# EAGLE design saha-display (EAGLE 9.4.0)
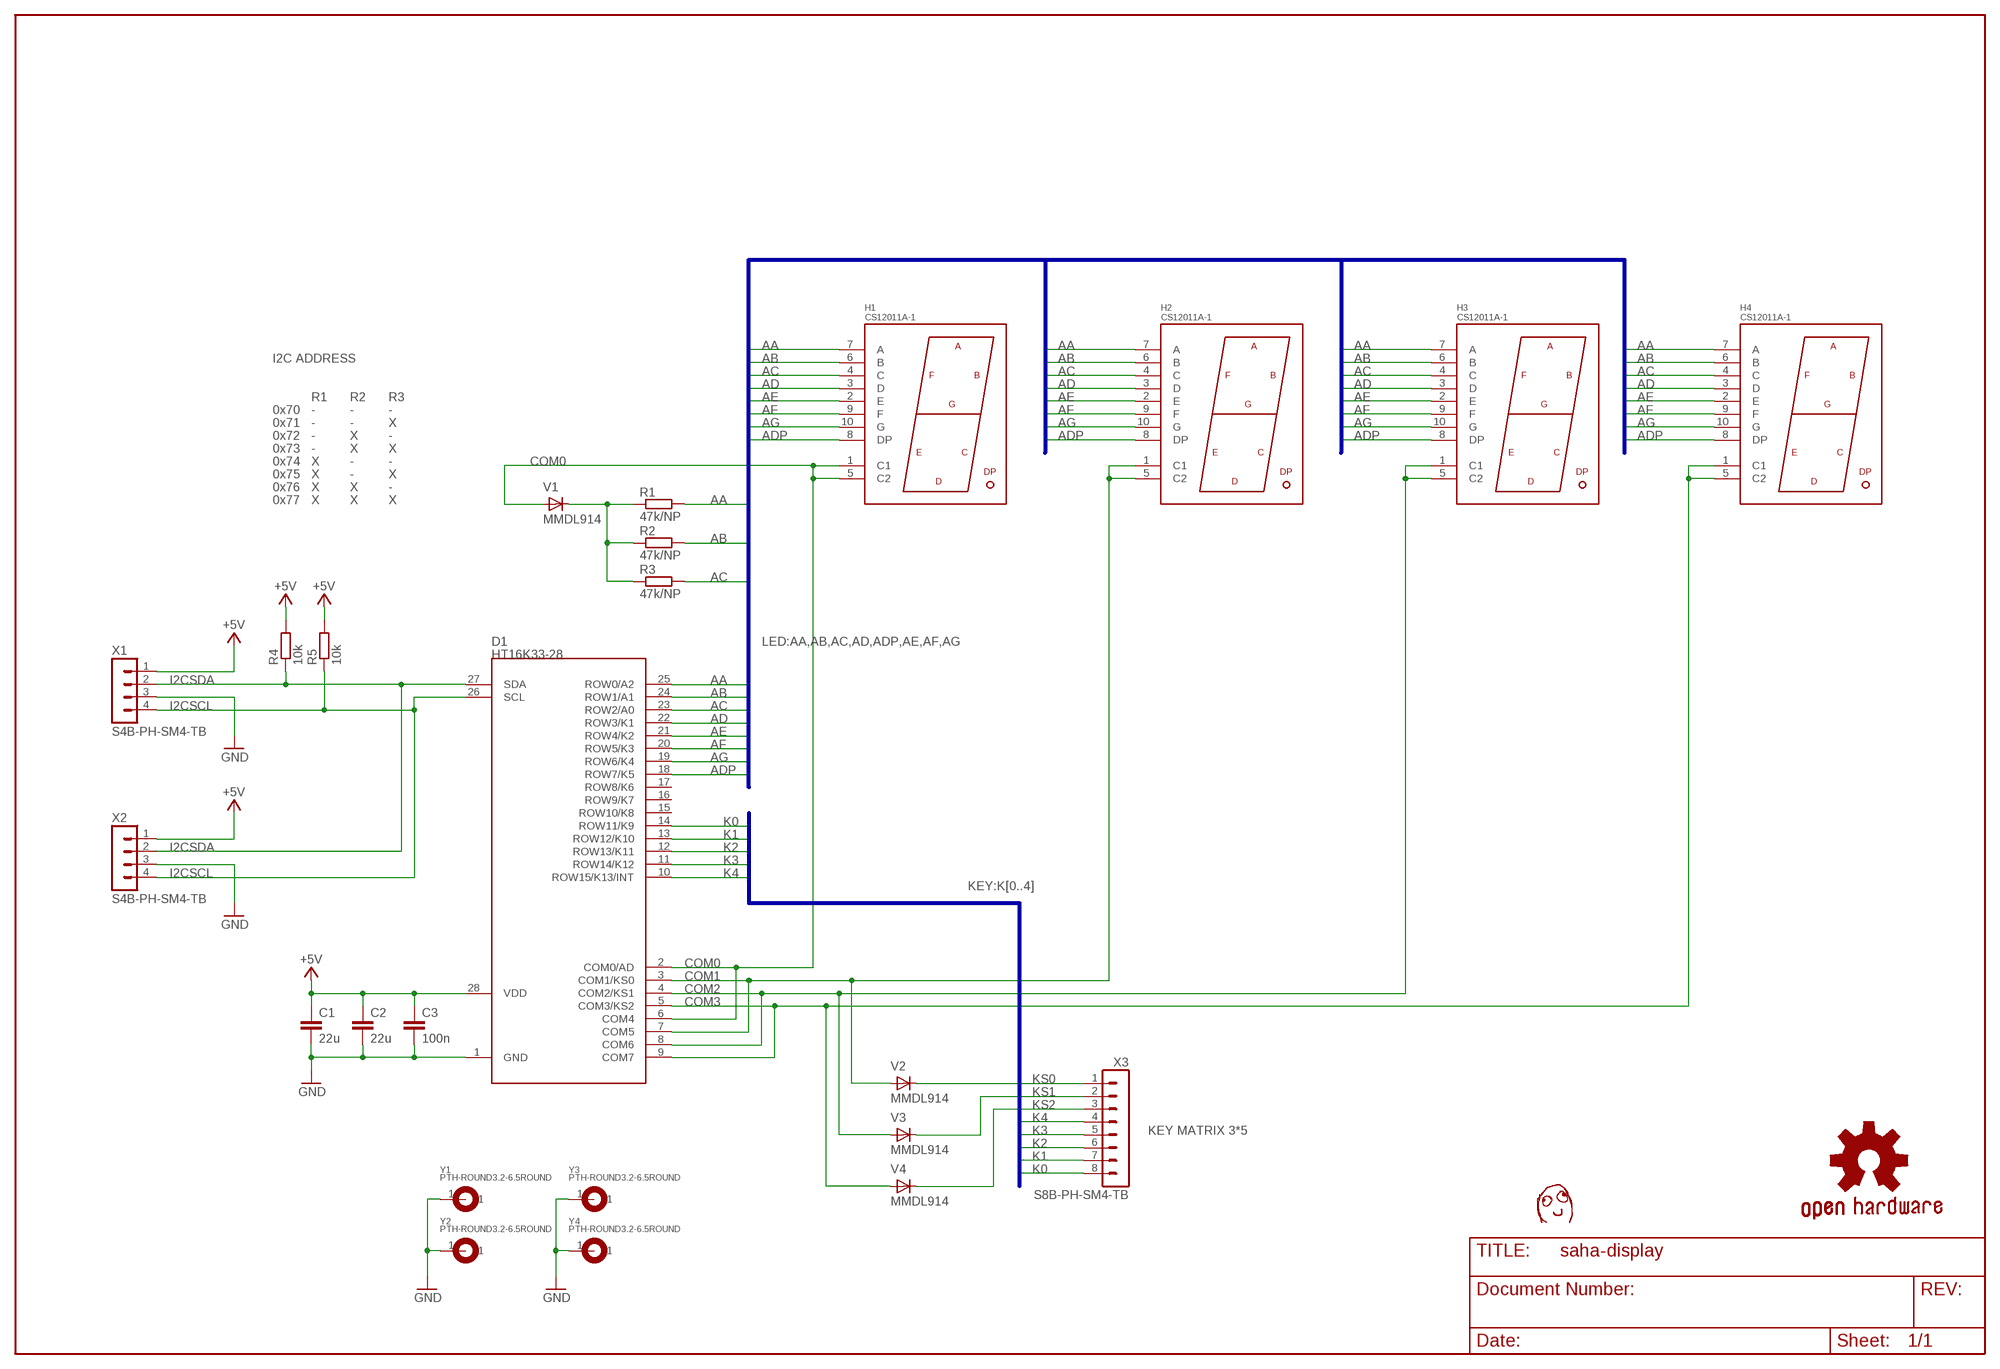
[diagram p0: schematic, sheet 1]

## Parts
C1  22u  CAP0805  [C0805]
C2  22u  CAP0805  [C0805]
C3  100n  CAP0603  [C0603]
D1  HT16K33-28  [SOP28-300]
H1  CS12011A-1  [7-SEGMENT-1.2INCH]
H2  CS12011A-1  [7-SEGMENT-1.2INCH]
H3  CS12011A-1  [7-SEGMENT-1.2INCH]
H4  CS12011A-1  [7-SEGMENT-1.2INCH]
R1  47k/NP  RES0603  [R0603]
R2  47k/NP  RES0603  [R0603]
R3  47k/NP  RES0603  [R0603]
R4  10k  RES0603  [R0603]
R5  10k  RES0603  [R0603]
U$1  DAFUG  [DAFUG]
V1  MMDL914  [SOD-323]
V2  MMDL914  [SOD-323]
V3  MMDL914  [SOD-323]
V4  MMDL914  [SOD-323]
X1  S4B-PH-SM4-TB  [JST-PH2.0-RA-4]
X2  S4B-PH-SM4-TB  [JST-PH2.0-RA-4]
X3  S8B-PH-SM4-TB  [JST-PH2.0-RA-8]
Y1  PTH-ROUND3.2-6.5ROUND  [EKE_PTH-3.2-6.5]
Y2  PTH-ROUND3.2-6.5ROUND  [EKE_PTH-3.2-6.5]
Y3  PTH-ROUND3.2-6.5ROUND  [EKE_PTH-3.2-6.5]
Y4  PTH-ROUND3.2-6.5ROUND  [EKE_PTH-3.2-6.5]

## Nets
+5V: C1.1 C2.1 C3.1 D1.28(VDD) R4.2 R5.2 X1.1 X2.1
AA: D1.25(ROW0/A2) H1.7(A) H2.7(A) H3.7(A) H4.7(A) R1.2
AB: D1.24(ROW1/A1) H1.6(B) H2.6(B) H3.6(B) H4.6(B) R2.2
AC: D1.23(ROW2/A0) H1.4(C) H2.4(C) H3.4(C) H4.4(C) R3.2
AD: D1.22(ROW3/K1) H1.3(D) H2.3(D) H3.3(D) H4.3(D)
ADP: D1.18(ROW7/K5) H1.8(DP) H2.8(DP) H3.8(DP) H4.8(DP)
AE: D1.21(ROW4/K2) H1.2(E) H2.2(E) H3.2(E) H4.2(E)
AF: D1.20(ROW5/K3) H1.9(F) H2.9(F) H3.9(F) H4.9(F)
AG: D1.19(ROW6/K4) H1.10(G) H2.10(G) H3.10(G) H4.10(G)
COM0 [CC]: D1.2(COM0/AD) D1.6(COM4) H1.1(C1) H1.5(C2) V1.A
COM1 [CC]: D1.3(COM1/KS0) D1.7(COM5) H2.1(C1) H2.5(C2) V2.A
COM2 [CC]: D1.4(COM2/KS1) D1.8(COM6) H3.1(C1) H3.5(C2) V3.A
COM3 [CC]: D1.5(COM3/KS2) D1.9(COM7) H4.1(C1) H4.5(C2) V4.A
GND: C1.2 C2.2 C3.2 D1.1(GND) X1.3 X2.3 Y1.1 Y2.1 Y3.1 Y4.1
I2CSCL: D1.26(SCL) R5.1 X1.4 X2.4
I2CSDA: D1.27(SDA) R4.1 X1.2 X2.2
K0: D1.14(ROW11/K9) X3.8
K1: D1.13(ROW12/K10) X3.7
K2: D1.12(ROW13/K11) X3.6
K3: D1.11(ROW14/K12) X3.5
K4: D1.10(ROW15/K13/INT) X3.4
KS0: V2.C X3.1
KS1: V3.C X3.2
KS2: V4.C X3.3
N$1: R1.1 R2.1 R3.1 V1.C
Unconnected: D1.15(ROW10/K8) D1.16(ROW9/K7) D1.17(ROW8/K6)

## Buses
LED:AA,AB,AC,AD,ADP,AE,AF,AG
KEY:K[0..4]

## Notes on the sheet
- I2C ADDRESS
- R1 | R2 | R3
- 0x70 | - | - | -
- 0x71 | - | - | X
- 0x72 | - | X | -
- 0x73 | - | X | X
- 0x74 | X | - | -
- 0x75 | X | - | X
- 0x76 | X | X | -
- 0x77 | X | X | X
- KEY MATRIX 3*5

## Library data of the parts
C1-C3 = saha-display:CAP
D1 = saha-display:HT16K33-28
H1-H4 = saha-display:CS12011A-1
R1-R5 = saha-display:RES
U$1 = saha-display:DAFUG
V1-V4 = saha-display:MMDL914
X1 X2 = saha-display:S4B-PH-SM4-TB
X3 = saha-display:S8B-PH-SM4-TB
Y1-Y4 = saha-display:PTH-ROUND

## Net classes
0 default: width 0.15 mm, drill 0.3 mm
1 CC: width 0.25 mm, drill 0.3 mm

## Board
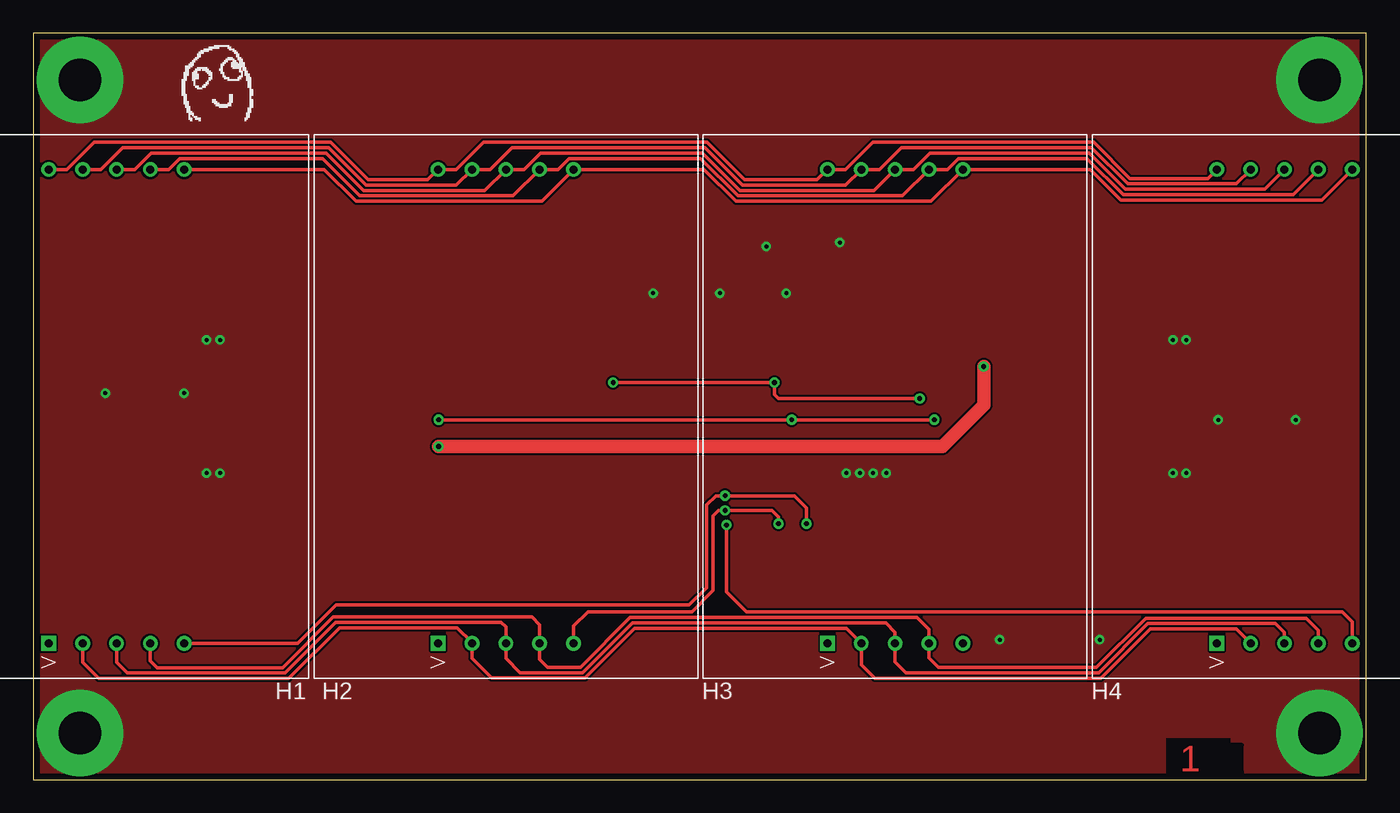
[diagram p1: board, top side]
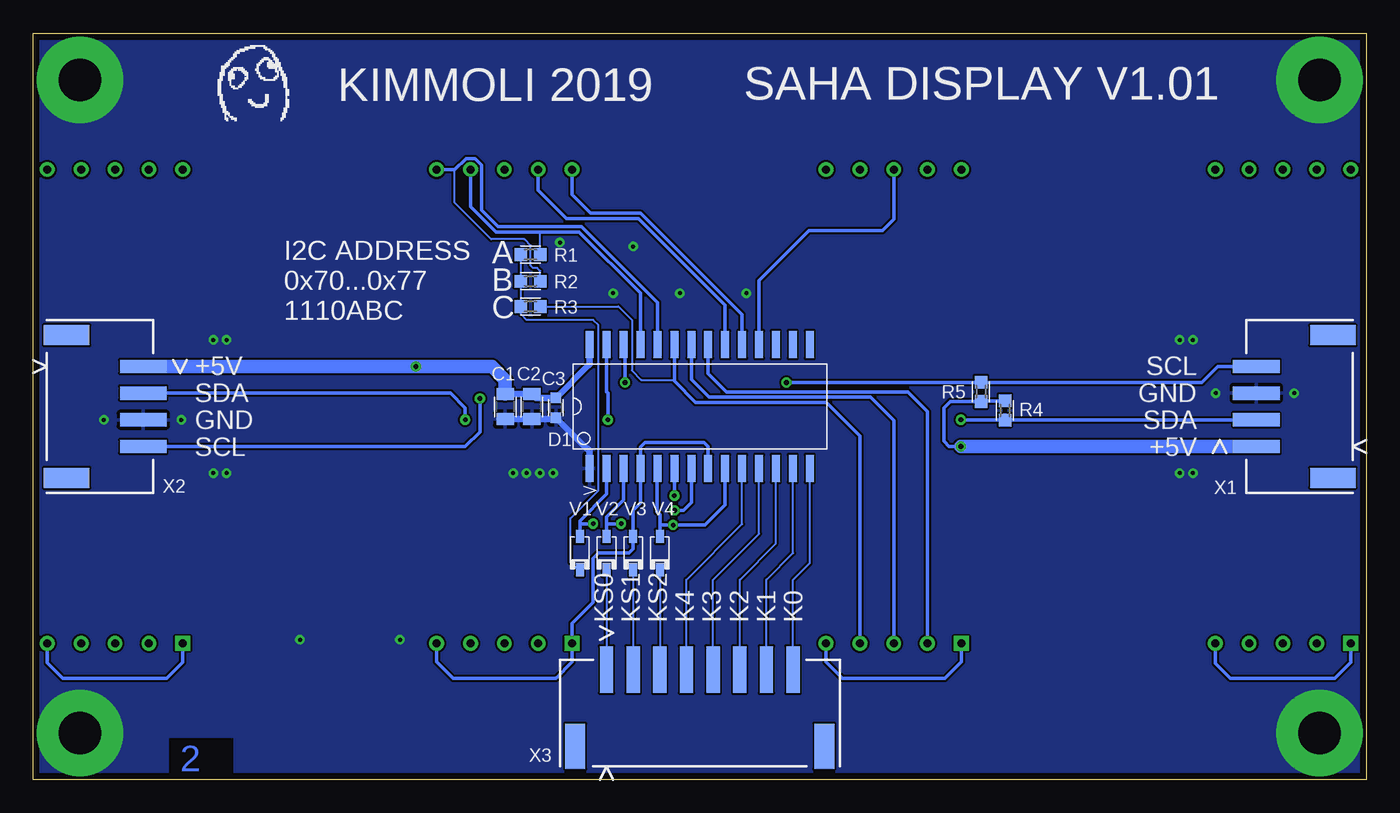
[diagram p2: board, bottom side, seen from below]

Size 100 x 56 mm. Coordinates in mm from the lower left corner, seen from the top.
Outline: 0,0 100,0 100,56 0,56 0,0
Copper layers (1*16): Top 0.035mm / dielectric 1.5mm / Bottom 0.035mm
Design rules "default *": minimum track width 6mil, minimum drill 0.35mm, track to track 6mil, track to pad 6mil, pad to pad 6mil, via to via 6mil, smd to smd 6mil, copper to edge 19mil, drill to drill 6mil, minimum pad ring 10mil, minimum via ring 8mil, stop-mask expansion 4mil, vias tented up to drill 0mil, thermal gap 10mil
tRestrict: area 85,0.4 to 89.8,3.1
bRestrict: area 85,0.4 to 89.8,3.1

### Footprints (pad centres in the part's own frame; a part is rotated, then mirrored left to right if it is on the bottom)
C0805 = smd 0.9 x 1.3: 1 -0.95,0; 2 0.95,0
C0603 = smd 0.8 x 0.8: 1 -0.75,0; 2 0.75,0
SOP28-300 = smd 2.05 x 0.6: 1 -4.65,8.255; 2 -4.65,6.985; 3 -4.65,5.715; 4 -4.65,4.445; 5 -4.65,3.175; 6 -4.65,1.905; 7 -4.65,0.635; 8 -4.65,-0.635; 9 -4.65,-1.905; 10 -4.65,-3.175; 11 -4.65,-4.445; 12 -4.65,-5.715; 13 -4.65,-6.985; 14 -4.65,-8.255; 15 4.65,-8.255; 16 4.65,-6.985; 17 4.65,-5.715; 18 4.65,-4.445; 19 4.65,-3.175; 20 4.65,-1.905; 21 4.65,-0.635; 22 4.65,0.635; 23 4.65,1.905; 24 4.65,3.175; 25 4.65,4.445; 26 4.65,5.715; 27 4.65,6.985; 28 4.65,8.255
7-SEGMENT-1.2INCH = drill 0.6 square: 1 -5.08,-17.78 | drill 0.6: 2 -2.54,-17.78; 3 0,-17.78; 4 2.54,-17.78; 5 5.08,-17.78; 6 5.08,17.78; 7 2.54,17.78; 8 0,17.78; 9 -2.54,17.78; 10 -5.08,17.78
R0603 = smd 0.95 x 0.95: 1 -0.725,0; 2 0.725,0
SOD-323 = smd 1 x 0.6: A 1.25,0; C -1.25,0
JST-PH2.0-RA-4 = smd 1 x 3.5: 1 3,-7.25; 2 1,-7.25; 3 -1,-7.25; 4 -3,-7.25 | smd 1.5 x 3.4: M1 5.35,-1.5; M2 -5.35,-1.5
JST-PH2.0-RA-8 = smd 1 x 3.5: 1 7,-7.25; 2 5,-7.25; 3 3,-7.25; 4 1,-7.25; 5 -1,-7.25; 6 -3,-7.25; 7 -5,-7.25; 8 -7,-7.25 | smd 1.5 x 3.4: M1 9.35,-1.5; M2 -9.35,-1.5
EKE_PTH-3.2-6.5 = drill 3.2 pad 6.5: 1 0,0

### Placement (x,y rotation side)
C1  64.6,28 270 bottom
C2  62.6,28 270 bottom
C3  60.8,27.9 270 bottom
D1  50,28 90 bottom
H1  6.24,28 0 top
H2  35.45,28 0 top
H3  64.66,28 0 top
H4  93.87,28 0 top
R1  62.7,39.4 0 bottom
R2  62.7,37.4 0 bottom
R3  62.7,35.5 0 bottom
R4  27.1,27.7 90 bottom
R5  28.9,29.1 270 bottom
U$1  14,52 0 top
U$3  DAFUG  [DAFUG]  83.3,52 0 bottom
V1  59,17 90 bottom
V2  57,17 90 bottom
V3  55,17 90 bottom
V4  53,17 90 bottom
X1  1,28 270 bottom
X2  99,28 90 bottom
X3  50,1 180 bottom
Y1  3.5,52.5 0 top
Y2  96.5,52.5 0 top
Y3  3.5,3.5 0 top
Y4  96.5,3.5 0 top

### Tracks (layer width: path | path; a pad name or v marks a point on that pad's centre or on a via)
+5V  (via drill 0.35)
  Top 1: v30.4,25 68.2,25 71.3,28.1 v71.3,31
  Bottom 0.25: R4.2 28.85,28.43 R5.2 31.2,28.38 31.7,27.88 31.7,25.4 31.3,25 v30.4,25
  Bottom 0.5: C1.1 C2.1 62.3,28.65 C3.1 58.35,31.1 58.3,31.1 58.26,31.14 D1.28
  Bottom 1: X1.1 v30.4,25 | X2.1 v71.3,31 65.6,31 64.6,30 C1.1
AA
  Top 0.25: H1.7 10.14,45.78 10.98,46.61 21.69,46.61 24.5,43.8 36.01,43.8 H2.7 39.35,45.78 40.19,46.61 50.06,46.61 52.87,43.8 65.22,43.8 H3.7 68.56,45.78 69.4,46.61 79.06,46.61 81.77,43.9 94.53,43.9 H4.7
  Bottom 0.152: R1.2 61.98,41.02 61.9,41.1
  Bottom 0.25: D1.25 54.45,36.5 59.05,41.1 61.9,41.1 65.3,41.1 67.2,43 H3.7 | R1.2 61.9,39.48
AB
  Top 0.25: H1.6 21.82,45.78 24.2,43.4 38.15,43.4 H2.6 50.32,45.78 52.7,43.4 67.36,43.4 H3.6 79.32,45.78 81.6,43.5 96.67,43.5 H4.6
  Bottom 0.152: 68.38,45.78 68.38,43.28 65.65,40.55 63.15,40.55 62.68,40.08 62.68,38.58 62.5,38.4 62.2,38.4 61.98,38.17 R2.2
  Bottom 0.25: D1.24 53.17,35.79 58.88,41.5 65.13,41.5 66.37,42.74 66.37,46.12 66.86,46.61 67.54,46.61 68.38,45.78 H3.6
AC
  Top 0.25: H1.4 8.78,8.92 9.3,8.4 18.7,8.4 22.5,12.2 37.4,12.2 37.99,11.61 H2.4 37.99,9.02 38.59,8.42 41.05,8.42 44.79,12.15 66.3,12.15 67.2,11.25 H3.4 67.2,9.12 67.92,8.4 79.77,8.4 83.47,12.11 95.5,12.11 96.41,11.19 H4.4
  Bottom 0.152: R3.2 56.1,35.5 55.1,34.5 55.1,30.7 54.4,30 51.91,30
  Bottom 0.25: D1.23 51.91,30 51.91,29.9 50.3,28.3 40.49,28.3 37.99,25.79 H2.4
AD
  Top 0.25: H1.3 6.24,8.78 7.03,8 18.9,8 22.7,11.8 35.1,11.8 35.45,11.45 H2.3 35.45,9.08 36.52,8.02 41.22,8.02 44.95,11.75 63.95,11.75 64.66,11.04 H3.3 64.66,8.82 65.48,8 79.93,8 83.63,11.7 93.2,11.7 93.87,11.03 H4.3
  Bottom 0.25: D1.22 50.63,30.04 49.3,28.7 37.2,28.7 35.45,26.95 H2.3
ADP
  Top 0.25: H1.8 7.6,45.78 8.84,47.01 21.99,47.01 24.8,44.2 33.88,44.2 H2.8 36.81,45.78 38.05,47.01 50.22,47.01 53.03,44.2 63.09,44.2 H3.8 66.02,45.78 67.26,47.01 79.22,47.01 81.93,44.3 92.39,44.3 H4.8
  Bottom 0.25: D1.18 45.55,37.45 41.8,41.2 36.3,41.2 35.45,42.05 H2.8
AE
  Top 0.25: H1.2 3.7,8.78 4.89,7.59 19.16,7.59 22.96,11.39 31.8,11.39 32.91,10.29 H2.2 32.91,9.08 34.38,7.62 41.39,7.62 45.12,11.35 60.99,11.35 H3.2 62.12,8.62 63.14,7.6 80.1,7.6 83.8,11.3 90.25,11.3 H4.2
  Bottom 0.25: D1.21 49.37,30.46 48,29.1 34.4,29.1 32.91,27.61 H2.2
AF
  Top 0.25: H1.9 5.06,45.78 6.7,47.42 22.15,47.42 24.96,44.61 31.74,44.61 H2.9 34.27,45.78 35.91,47.42 50.39,47.42 53.2,44.61 60.95,44.61 H3.9 63.48,45.78 65.12,47.42 79.39,47.42 82.1,44.71 90.26,44.71 H4.9
  Bottom 0.25: D1.20 48.09,35.59 54.6,42.1 60,42.1 62.12,44.22 H3.9
AG
  Top 0.25: H1.10 2.52,45.78 4.56,47.82 22.32,47.82 25.13,45.01 29.6,45.01 H2.10 31.73,45.78 33.77,47.82 50.56,47.82 53.37,45.01 58.81,45.01 H3.10 60.94,45.78 62.98,47.82 79.56,47.82 82.27,45.11 88.12,45.11 H4.10
  Bottom 0.25: D1.19 46.83,34.89 54.43,42.5 58.2,42.5 59.58,43.88 H3.10
COM0  (via drill 0.35)
  Top 0.25: H1.5 19.82,10.22 22.7,13.1 49.2,13.1 50.5,14.4 50.5,20.6 51.2,21.3 v51.91,21.3 57.1,21.3 58,20.4 v58,19.2
  Bottom 0.25: V1.A 59,19.2 | 59,19.2 59,19.4 56.98,21.41 D1.2 | H1.1 1.16,8.8 2.36,7.6 10.2,7.6 11.32,8.72 H1.5 | 59,19.2 v58,19.2 | D1.6 v51.91,21.3
COM1  (via drill 0.35)
  Top 0.25: H2.5 40.53,11.53 41.6,12.6 49.4,12.6 51,14.2 51,19.8 51.4,20.2 v51.9,20.2 55.4,20.2 55.9,19.7 v55.9,19.2
  Bottom 0.25: V2.A 57,19.2 | 57,19.2 57,19.7 55.72,20.98 D1.3 | H2.1 30.37,8.83 31.6,7.6 39.3,7.6 40.53,8.83 H2.5 | v55.9,19.2 57,19.2 | D1.7 50.63,20.8 51.23,20.2 v51.9,20.2
COM2
  Bottom 0.25: H3.5 69.74,8.84 68.5,7.6 60.8,7.6 59.58,8.82 H3.1 59.58,11.72 58,13.3 58,16.6 57.6,17 55.3,17 55,17.3 V3.A 55,20.2 54.45,20.75 D1.4 54.45,24.95 54.1,25.3 49.66,25.3 49.37,25 D1.8
COM3  (via drill 0.35)
  Top 0.25: H4.5 98.95,11.85 98.2,12.6 53.5,12.6 52,14.1 v52,19.1
  Bottom 0.25: V4.A 53,19.1 | 53,19.1 53,19.9 53.2,20.1 53.2,23.35 D1.5 | H4.1 88.79,8.81 90,7.6 97.8,7.6 98.96,8.76 H4.5 | 53,19.1 v52,19.1 49.6,19.1 48.09,20.61 D1.9
GND  (via drill 0.3)
  Bottom 0.5: C1.2 C2.2 60.9,27.05 C3.2 58.45,24.8 58.4,24.8 58.26,24.66 D1.1
  other vias: 14,33 14,23 13,23 13,33 61,23 62,23 63,23 64,23 86.5,23 85.5,23 86.5,33 85.5,33 72.5,10.5 80,10.5 56.5,36.5 60.5,40.3 55,40 51.5,36.5 46.5,36.5 11.3,29 5.4,29 88.9,27 94.7,27
  pour Top: 0,0 100,0 100,56 0,56
  pour Bottom: 0,0 100,0 100,56 0,56
I2CSCL  (via drill 0.35)
  Top 0.25: v43.5,29.8 v55.61,29.8 v55.6,29.79 55.6,28.9 55.9,28.6 v66.5,28.6
  Bottom 0.25: v43.5,29.8 28.9,29.8 | 28.9,29.8 12.35,29.8 11.15,31 X1.4 | v55.61,29.8 55.61,32.54 D1.26 | X2.4 67.6,25 66.5,26.1 v66.5,28.6 | R5.1 28.9,29.8
I2CSDA  (via drill 0.35)
  Top 0.25: v30.4,27 v56.9,27 v67.6,27
  Bottom 0.25: X1.2 27.1,27 v30.4,27 | D1.27 56.9,32.56 57,32.47 57,29.1 56.9,29 v56.9,27 | X2.2 68.7,29 67.6,27.9 v67.6,27
  Bottom 1: R4.1 27.1,27
K0
  Bottom 0.152: D1.14 41.74,16.25 43,15 X3.8
K1
  Bottom 0.152: X3.7 45,15 43,17 43,23.34 D1.13
K2
  Bottom 0.152: X3.6 47,15 44.28,17.71 D1.12
K3
  Bottom 0.152: X3.5 49,15 45.55,18.45 D1.11
K4
  Bottom 0.152: X3.4 51,15 46.83,19.18 D1.10
KS0
  Bottom 0.152: V2.C X3.1
KS1
  Bottom 0.152: V3.C X3.2
KS2
  Bottom 0.152: V4.C X3.3
N$1
  Bottom 0.152: V1.C 59.15,15.75 59.7,16.3 59.7,19.6 57.6,21.7 57.6,34.1 58,34.5 63,34.5 63.42,34.92 R3.1 R2.1 R1.1

### Text on the board
Top: 1
Bottom: 2
bPlace: SAHA DISPLAY V1.01 | KIMMOLI 2019 | A / B / C | I2C ADDRESS / 0x70...0x77 / 1110ABC | SCL / GND / SDA / +5V | +5V / SDA / GND / SCL | KS0 / KS1 / KS2 / K4 / K3 / K2 / K1 / K0